# EAGLE design JaysCarECUAdapter (EAGLE 7.4.0)
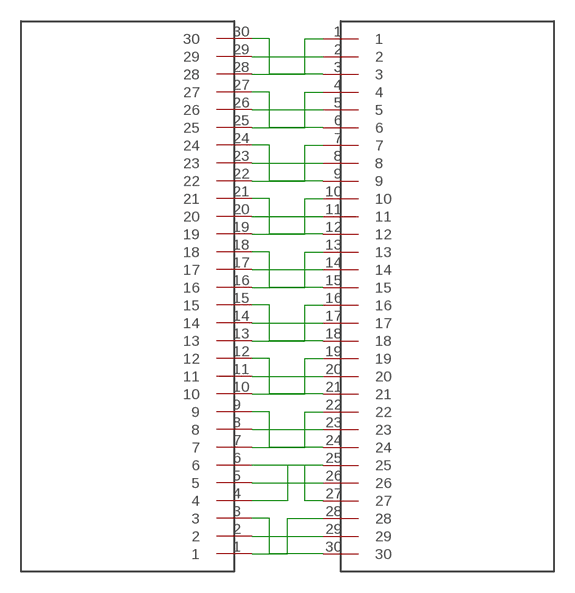
[diagram p0: schematic, sheet 1]

## Parts
U$1  CINCH_581_01_60_001  [CINCH_581_01_60_001]
U$2  CINCH_581_01_60_001  [CINCH_581_01_60_001]

## Nets
N$1: U$1.26 U$2.5
N$2: U$1.27 U$2.6
N$3: U$1.25 U$2.4
N$4: U$1.23 U$2.8
N$5: U$1.24 U$2.9
N$6: U$1.22 U$2.7
N$7: U$1.20 U$2.11
N$8: U$1.19 U$2.10
N$9: U$1.21 U$2.12
N$10: U$1.17 U$2.14
N$11: U$1.16 U$2.13
N$12: U$1.18 U$2.15
N$13: U$1.14 U$2.17
N$14: U$1.13 U$2.16
N$15: U$1.15 U$2.18
N$16: U$1.11 U$2.20
N$17: U$1.10 U$2.19
N$18: U$1.12 U$2.21
N$19: U$1.8 U$2.23
N$20: U$1.9 U$2.24
N$21: U$1.7 U$2.22
N$22: U$1.5 U$2.26
N$23: U$1.4 U$2.25
N$24: U$1.6 U$2.27
N$25: U$1.2 U$2.29
N$26: U$1.3 U$2.30
N$27: U$1.1 U$2.28
N$28: U$1.28 U$2.1
N$29: U$1.29 U$2.2
N$30: U$1.30 U$2.3

## Library data of the parts
U$1 U$2 = Cinch:CINCH_581_01_60_001: CINCH 581 01 60 001

## Board
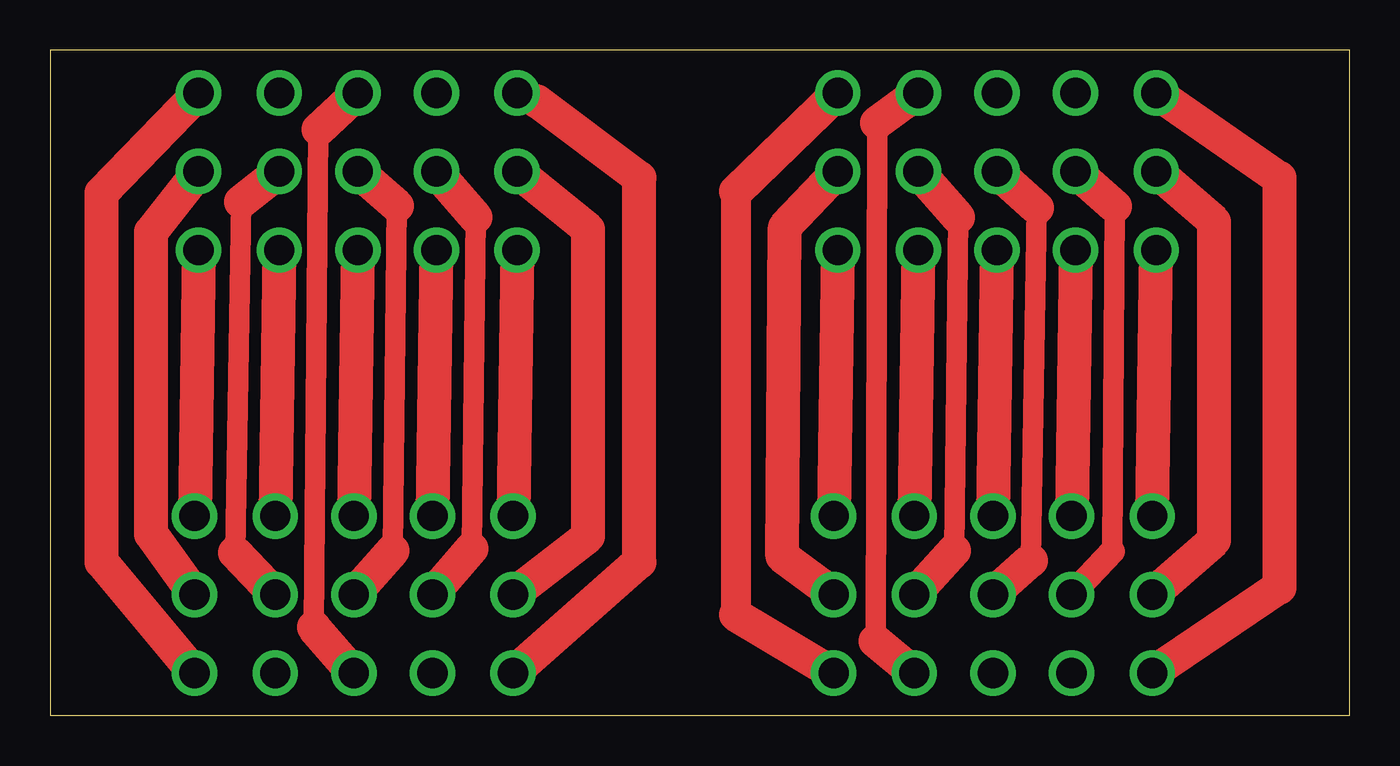
[diagram p1: board, top side]
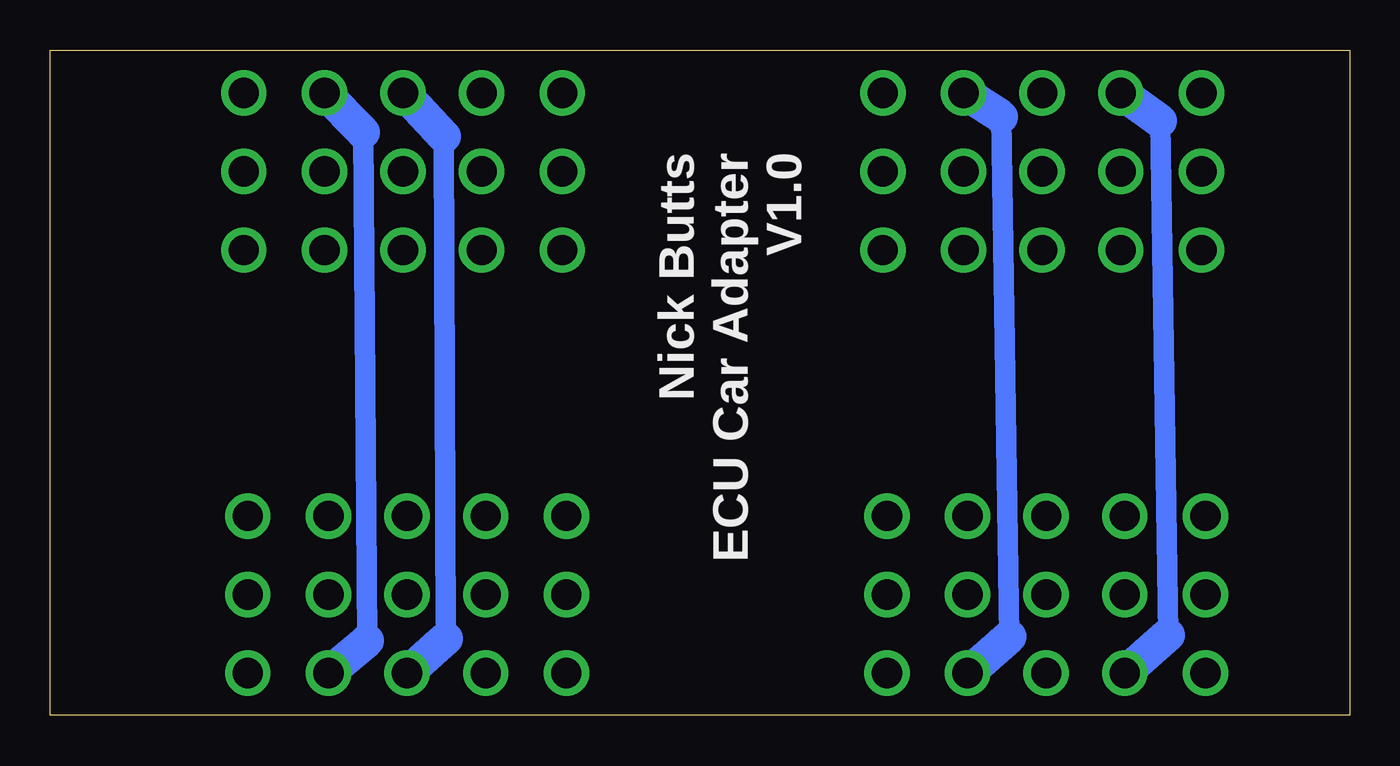
[diagram p2: board, bottom side, seen from below]

Size 64.44 x 33.01 mm. Coordinates in mm from the lower left corner, seen from the top.
Outline: 0,0 64.44,0 64.44,33.01 0,33.01 0,0
Copper layers (1*16): Top 0.035mm / dielectric 1.5mm / Bottom 0.035mm
Design rules "default": minimum track width 10mil, minimum drill 24mil, track to track 8mil, track to pad 8mil, pad to pad 8mil, via to via 8mil, smd to smd 8mil, copper to edge 40mil, drill to drill 8mil, minimum pad ring 10mil, minimum via ring 8mil, stop-mask expansion 4mil, vias tented up to drill 0mil, thermal gap 10mil

### Footprints (pad centres in the part's own frame; a part is rotated, then mirrored left to right if it is on the bottom)
CINCH_581_01_60_001 = drill 1.5: 1 -23.85,3.9; 2 -23.85,0; 3 -23.85,-3.9; 4 -19.85,3.9; 5 -19.85,0; 6 -19.85,-3.9; 7 -15.95,3.9; 8 -15.95,0; 9 -15.95,-3.9; 10 -12.05,3.9; 11 -12.05,0; 12 -12.05,-3.9; 13 -8.05,3.9; 14 -8.05,0; 15 -8.05,-3.9; 16 7.85,3.9; 17 7.85,0; 18 7.85,-3.9; 19 11.85,3.9; 20 11.85,0; 21 11.85,-3.9; 22 15.75,3.9; 23 15.75,0; 24 15.75,-3.9; 25 19.65,3.9; 26 19.65,0; 27 19.65,-3.9; 28 23.65,3.9; 29 23.65,0; 30 23.65,-3.9

### Placement (x,y rotation side)
U$1  31,27 180 top
U$2  31,6 0 top

### Tracks (layer width: path | path; a pad name or v marks a point on that pad's centre or on a via)
N$1
  Top 1.016: 9.16,8.09 9.46,25.5
  Top 1.676: U$2.5 9.16,8.09 | 9.46,25.5 U$1.26
N$2
  Bottom 1.016: 9,4 9.4,29.5
  Bottom 1.676: U$2.6 9,4 | 9.4,29.5 U$1.27
N$3
  Top 1.676: U$1.25 U$2.4
N$4
  Top 1.016: 16.98,8.19 17.18,25.3
  Top 1.676: U$2.8 16.98,8.19 | 17.18,25.3 U$1.23
N$5
  Top 1.016: 13.07,4.38 13.3,29.08
  Top 1.676: U$2.9 13.07,4.38 | 13.3,29.08 U$1.24
N$6
  Top 1.676: U$1.22 U$2.7
N$7
  Top 1.016: 20.89,8.29 21.09,24.73
  Top 1.676: U$2.11 20.89,8.29 | 21.09,24.73 U$1.20
N$8
  Top 1.676: U$1.19 U$2.10
N$9
  Bottom 1.016: 16.88,3.91 17.28,29.71
  Bottom 1.676: U$2.12 16.88,3.91 | 17.28,29.71 U$1.21
N$10
  Top 1.676: U$2.14 26.67,8.89 26.67,24.13 U$1.17
N$11
  Top 1.676: U$1.16 U$2.13
N$12
  Top 1.27: 24.13,30.48 U$1.18
  Top 1.676: U$2.15 29.21,7.62 29.21,26.67 24.13,30.48
N$13
  Top 1.676: U$2.17 36.3,7.9 36.43,24.23 U$1.14
N$14
  Top 1.676: U$1.13 U$2.16
N$15
  Top 1.5: 34,26 34,5
  Top 1.676: U$1.15 34,26 | 34,5 U$2.18
N$16
  Top 1.016: 44.82,8.19 45.02,24.73
  Top 1.676: U$2.20 44.82,8.19 | 45.02,24.73 U$1.11
N$17
  Top 1.676: U$1.10 U$2.19
N$18
  Top 1.016: 40.93,3.69 41.01,29.41
  Top 1.676: U$2.21 40.93,3.69 | 41.01,29.41 U$1.12
N$19
  Top 1.016: 48.63,7.69 48.93,25.2
  Top 1.676: U$2.23 48.63,7.69 | 48.93,25.2 U$1.8
N$20
  Bottom 1.016: 44.82,3.81 44.92,28.74
  Bottom 1.676: U$2.24 44.82,3.81 | 44.92,28.74 U$1.9
N$21
  Top 1.676: U$1.7 U$2.22
N$22
  Top 1.016: 52.67,8.15 52.79,25.27
  Top 1.27: U$2.26 52.67,8.15
  Top 1.676: 52.79,25.27 U$1.5
N$23
  Top 1.676: U$1.4 U$2.25
N$24
  Bottom 1.016: 48.73,3.71 48.93,28.94
  Bottom 1.676: U$2.27 48.73,3.71 | 48.93,28.94 U$1.6
N$25
  Top 1.676: U$2.29 57.72,8.69 57.72,24.5 U$1.2
N$26
  Top 1.676: U$1.3 60.96,26.67 60.96,6.35 U$2.30
N$27
  Top 1.676: U$2.28 U$1.1
N$28
  Top 1.676: U$1.28 U$2.1
N$29
  Top 1.676: U$2.2 5,9 5,24 U$1.29
N$30
  Top 1.676: U$2.3 2.54,7.62 2.54,25.94 U$1.30

### Text on the board
bNames: Nick Butts / ECU Car Adapter / V1.0
bDocu: Nick Butts / Car ECU Adapter / V1.0